# EAGLE schematic Meshtastic-DIY_v4_TTGO-T8-18 (EAGLE 9.6.2)
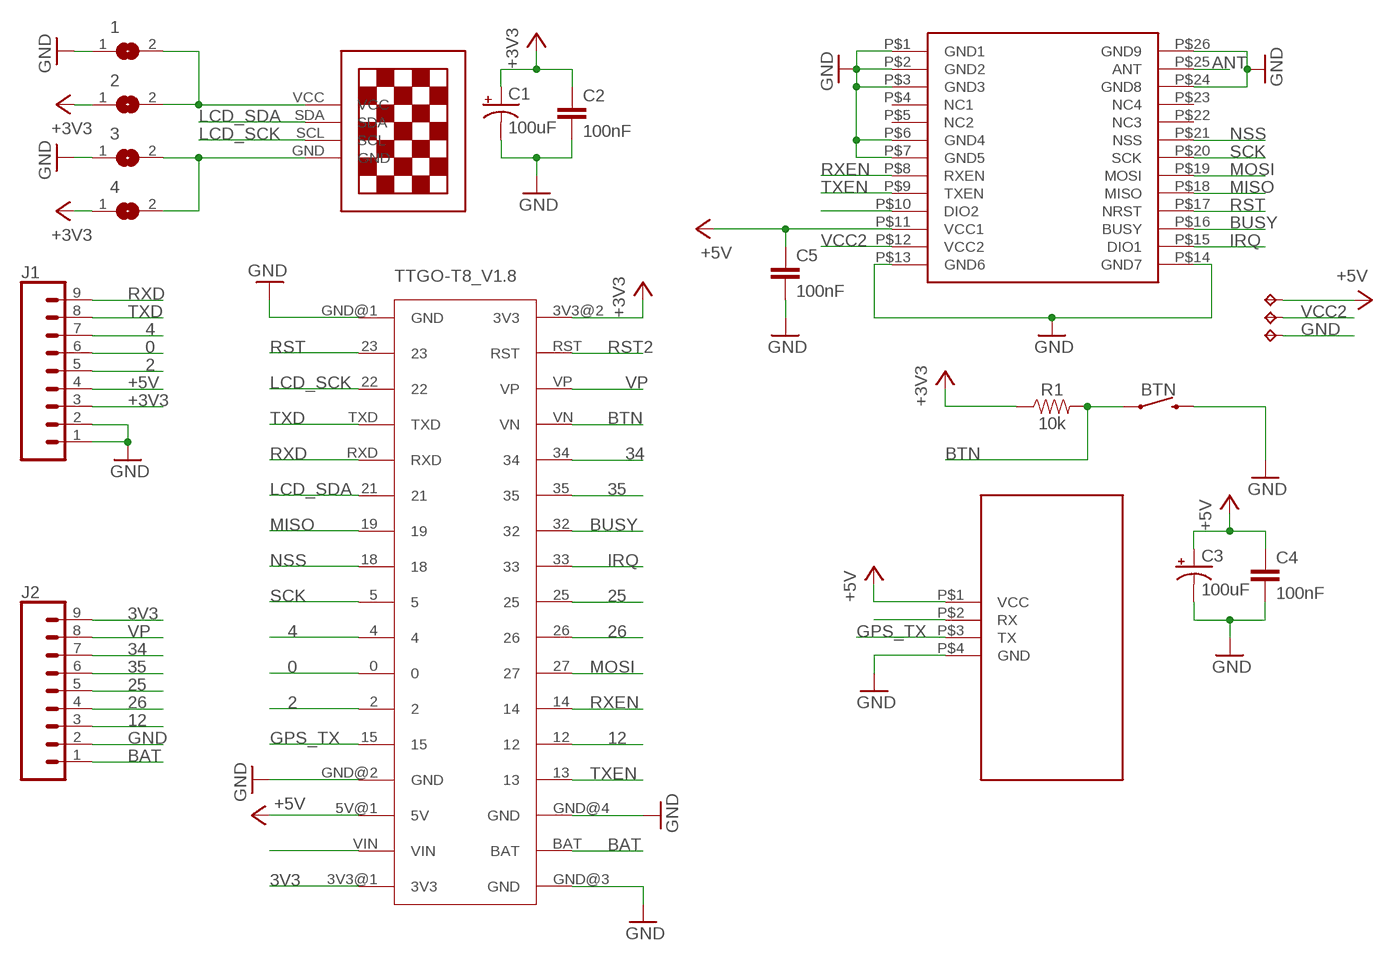
[diagram p0: schematic, sheet 1]

## Parts
1  SJ  [SJ]
2  SJ  [SJ]
3  SJ  [SJ]
4  SJ  [SJ]
BTN  MOMENTARY-SWITCH-SPST-SMD-5.2MM  [TACTILE_SWITCH_SMD_5.2MM]
C1  100uF  100UF-POLAR-EIA7343-10V-10%(TANT)  [EIA7343]
C2  100nF  0.33UF/330NF-0805-50V-10%  [0805]
C3  100uF  100UF-POLAR-EIA7343-10V-10%(TANT)  [EIA7343]
C4  100nF  0.33UF/330NF-0805-50V-10%  [0805]
C5  100nF  0.33UF/330NF-0805-50V-10%  [0805]
J1  CONN_09NO_SILK  [1X09_NO_SILK]
J2  CONN_09NO_SILK  [1X09_NO_SILK]
R1  10k  0.1OHM-1210-1/2W-1%  [1210]
TP1  TPTP14SQ  [TP14SQ]
TP2  TPTP14SQ  [TP14SQ]
TP3  TPTP14SQ  [TP14SQ]
TTGO-T8_V1.8  TTGO-T8_V18  [TTGO-T8_V18]
U$1  13"OLED13"OLED  [1.3"OLED]
U$2  E22-XXXMXXS  [E22-XXXMXXS]
U$3  GPS-NEO  [GPS-NEO]

## Nets
0: J1.6 TTGO-T8_V1.8.0
2: J1.5 TTGO-T8_V1.8.2
3V3: J2.9 TTGO-T8_V1.8.3V3@1(3V3)
4: J1.7 TTGO-T8_V1.8.4
12: J2.3 TTGO-T8_V1.8.12
25: J2.5 TTGO-T8_V1.8.25
26: J2.4 TTGO-T8_V1.8.26
34: J2.7 TTGO-T8_V1.8.34
35: J2.6 TTGO-T8_V1.8.35
+3V3: 2.1 4.1 C1.A(+) C2.1 J1.3 R1.1 TTGO-T8_V1.8.3V3@2(3V3)
+5V: C3.A(+) C4.1 C5.1 J1.4 TP1.TP TTGO-T8_V1.8.5V@1(5V) U$2.P$11(VCC1) U$3.P$1(VCC)
ANT: U$2.P$25(ANT)
BAT: J2.1 TTGO-T8_V1.8.BAT
BTN: BTN.1 R1.2 TTGO-T8_V1.8.VN
BUSY: TTGO-T8_V1.8.32 U$2.P$16(BUSY)
GND: 1.1 3.1 BTN.3 C1.C(-) C2.2 C3.C(-) C4.2 C5.2 J1.1 J1.2 J2.2 TP3.TP TTGO-T8_V1.8.GND@1(GND) TTGO-T8_V1.8.GND@2(GND) TTGO-T8_V1.8.GND@3(GND) TTGO-T8_V1.8.GND@4(GND) U$2.P$1(GND1) U$2.P$2(GND2) U$2.P$3(GND3) U$2.P$6(GND4) U$2.P$7(GND5) U$2.P$13(GND6) U$2.P$14(GND7) U$2.P$24(GND8) U$2.P$26(GND9) U$3.P$4(GND)
GPS_TX: TTGO-T8_V1.8.15 U$3.P$3(TX)
IRQ: TTGO-T8_V1.8.33 U$2.P$15(DIO1)
LCD_SCK: TTGO-T8_V1.8.22 U$1.SCL
LCD_SDA: TTGO-T8_V1.8.21 U$1.SDA
MISO: TTGO-T8_V1.8.19 U$2.P$18(MISO)
MOSI: TTGO-T8_V1.8.27 U$2.P$19(MOSI)
N$1: U$2.P$10(DIO2)
N$2: 3.2 4.2 U$1.GND
N$3: U$3.P$2(RX)
N$4: 1.2 2.2 U$1.VCC
N$40: TTGO-T8_V1.8.VIN
NSS: TTGO-T8_V1.8.18 U$2.P$21(NSS)
RST: TTGO-T8_V1.8.23 U$2.P$17(NRST)
RST2: TTGO-T8_V1.8.RST
RXD: J1.9 TTGO-T8_V1.8.RXD
RXEN: TTGO-T8_V1.8.14 U$2.P$8(RXEN)
SCK: TTGO-T8_V1.8.5 U$2.P$20(SCK)
TXD: J1.8 TTGO-T8_V1.8.TXD
TXEN: TTGO-T8_V1.8.13 U$2.P$9(TXEN)
VCC2: TP2.TP U$2.P$12(VCC2)
VP: J2.8 TTGO-T8_V1.8.VP
Unconnected: U$2.P$4(NC1) U$2.P$5(NC2) U$2.P$22(NC3) U$2.P$23(NC4)

## Library data of the parts
1-4 = jumper:SJ: SMD solder JUMPER
BTN = SparkFun-Switches:MOMENTARY-SWITCH-SPST: Momentary Switch (Pushbutton) - SPST Normally-open (NO) SPST momentary switches (buttons, pushbuttons). Variants PTH-12MM - 12mm square, through-hole Momentary Pushbutton Switch - 12mm Square <https://www.sparkfun.com/products/9190> (COM-09190) PTH-6.0MM, PTH-6.0MM-KIT - 6.0mm square, through-hole Mini Pushbutton Switch <https://www.sparkfun.com/products/97> (COM-00097) KIT package intended for soldering kit's - only one side of pads' copper is exposed. PTH-RIGHT-ANGLE-KIT - Right-angle, through-hole Right Angle Tactile Button <https://www.sparkfun.com/products/10791> - Used on SparkFun BigTime Watch Kit <https://www.sparkfun.com/products/11734> SMD-12MM - 12mm square, surface-mount Tactile Button - SMD (12mm) <https://www.sparkfun.com/products/12993> (COM-12993) Used on SparkFun PicoBoard <https://www.sparkfun.com/products/11888> SMD-4.5MM - 4.5mm Square Trackball Switch Used on SparkFun Blackberry Trackballer Breakout <https://www.sparkfun.com/products/13169> SMD-4.6MMX2.8MM - 4.60mm x 2.80mm, surface mount Used on SparkFun SAMD21 Mini Breakout <https://www.sparkfun.com/products/13664> SMD-5.2MM, SMD-5.2-REDUNDANT - 5.2mm square, surface-mount Mini Pushbutton Switch - SMD <https://www.sparkfun.com/products/8720> (COM-08720) Used on Arduino Pro Mini <https://www.sparkfun.com/products/11114> REDUNDANT package connects both switch circuits together SMD-6.0X3.5MM - 6.0 x 3.5mm, surface mount Momentary Reset Switch SMD <https://www.sparkfun.com/products/8229> (COM-08229) SMD-6.2MM-TALL - 6.2mm square, surface mount Tactile Button - SMD (6mm) <https://www.sparkfun.com/products/12992> Used on SparkFun Digital Sandbox <https://www.sparkfun.com/products/12651> SMD-RIGHT-ANGLE - Right-angle, surface mount Used on SparkFun Block for Intel® Edison - Arduino <https://www.sparkfun.com/products/13036>; PROD_ID: SWCH-08247; SF_SKU: COM-08720
C1 C3 = SparkFun-Capacitors:100UF-POLAR: 100µF polarized capacitors A capacitor is a passive two-terminal electrical component used to store electrical energy temporarily in an electric field.; PROD_ID: CAP-07890
C2 C4 C5 = SparkFun-Capacitors:0.33UF/330NF: 0.33µF/330nF ceramic capacitors A capacitor is a passive two-terminal electrical component used to store electrical energy temporarily in an electric field.; PROD_ID: CAP-08469; VALUE: 0.33µF
J1 J2 = SparkFun-Connectors:CONN_09: Multi connection point. Often used as Generic Header-pin footprint for 0.1 inch spaced/style header connections On any of the 0.1 inch spaced packages, you can populate with these: Break Away Headers - Straight <https://www.sparkfun.com/products/116> (PRT-00116) Break Away Male Headers - Right Angle <https://www.sparkfun.com/products/553> (PRT-00553) Female Headers <https://www.sparkfun.com/products/115> (PRT-00115) Break Away Headers - Machine Pin <https://www.sparkfun.com/products/117> (PRT-00117) Break Away Female Headers - Swiss Machine Pin <https://www.sparkfun.com/products/743> (PRT-00743) For SCREWTERMINALS and SPRING TERMINALS visit here: Screw Terimnals on SparkFun.com <https://www.sparkfun.com/search/results?term=Screw+Terminals> (5mm/3.5mm/2.54mm spacing) This device is also useful as a general connection point to wire up your design to another part of your project. Our various solder wires solder well into these plated through hole pads. Hook-Up Wire - Assortment (Stranded, 22 AWG) <https://www.sparkfun.com/products/11375> (PRT-11375) Hook-Up Wire - Assortment (Solid Core, 22 AWG) <https://www.sparkfun.com/products/11367> (PRT-11367) View the entire wire category on our website here <https://www.sparkfun.com/categories/141> Special notes: Molex polarized connector foot print use with SKU : PRT-08231 with associated crimp pins and housings. 1MM SMD Version SKU: PRT-10208 NOTES ON THE VARIANTS LOCK and LOCK_LONGPADS... This footprint was designed to help hold the alignment of a through-hole component (i.e. 6-pin header) while soldering it into place. You may notice that each hole has been shifted either up or down by 0.005 of an inch from it's more standard position (which is a perfectly straight line). This slight alteration caused the pins (the squares in the middle) to touch the edges of the holes. Because they are alternating, it causes a "brace" to hold the component in place. 0.005 has proven to be the perfect amount of "off-center" position when using our standard breakaway headers. Although looks a little odd when you look at the bare footprint, once you have a header in there, the alteration is very hard to notice. Also,if you push a header all the way into place, it is covered up entirely on the bottom side.
R1 = SparkFun-Resistors:0.1OHM: 0.1Ω resistor A resistor is a passive two-terminal electrical component that implements electrical resistance as a circuit element. Resistors act to reduce current flow, and, at the same time, act to lower voltage levels within circuits. - Wikipedia; PROD_ID: RES-12374; VALUE: 0.1
TP1-TP3 = testpad:TP: Test pad
TTGO-T8_V1.8 = TTGO-T8:TTGO-T8_V18: TTGO T8 V1.8
U$1 = 13oled:13"OLED
U$2 = E22-XXXMXXS:E22-XXXMXXS
U$3 = 13oled:GPS-NEO